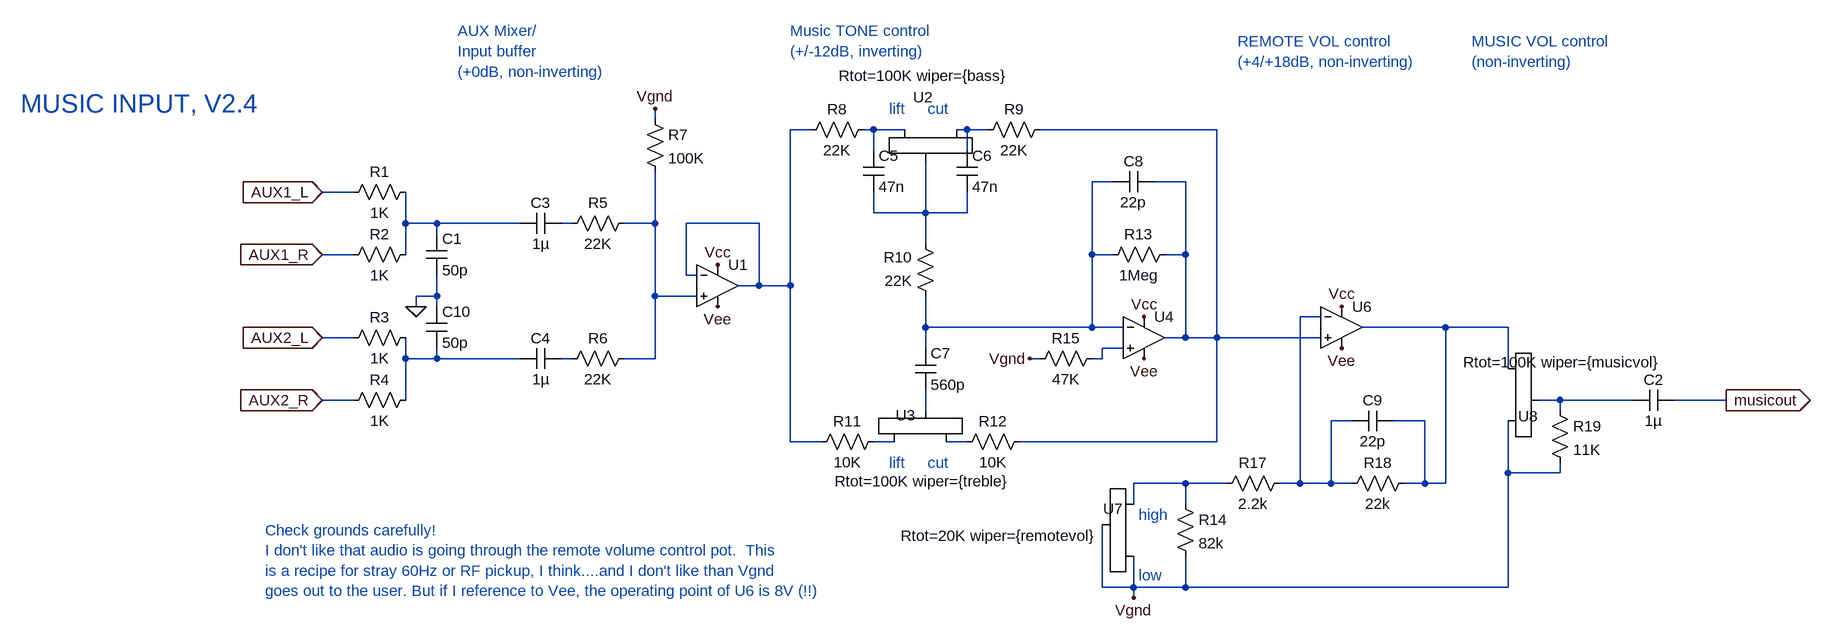
[diagram p0: schematic NewMusicInput_V2.4.asc]
NewMusicInput_V2.4.asc, the LTspice schematic file:
Version 4
SHEET 1 2328 872
WIRE 480 -32 480 -48
WIRE 720 -16 688 -16
WIRE 816 -16 800 -16
WIRE 864 -16 816 -16
WIRE 960 -16 944 -16
WIRE 992 -16 960 -16
WIRE 1344 -16 1072 -16
WIRE 816 16 816 -16
WIRE 960 16 960 -16
WIRE 1184 64 1152 64
WIRE 1296 64 1248 64
WIRE 16 80 -32 80
WIRE 816 112 816 80
WIRE 896 112 896 32
WIRE 896 112 816 112
WIRE 960 112 960 80
WIRE 960 112 896 112
WIRE 96 128 96 80
WIRE 144 128 96 128
WIRE 272 128 144 128
WIRE 352 128 336 128
WIRE 480 128 480 48
WIRE 480 128 432 128
WIRE 640 128 528 128
WIRE 144 144 144 128
WIRE 896 160 896 112
WIRE 16 176 -32 176
WIRE 96 176 96 128
WIRE 1152 176 1152 64
WIRE 1184 176 1152 176
WIRE 1296 176 1296 64
WIRE 1296 176 1264 176
WIRE 528 208 528 128
WIRE 544 208 528 208
WIRE 640 224 640 128
WIRE 640 224 608 224
WIRE 688 224 688 -16
WIRE 688 224 640 224
WIRE 144 240 144 208
WIRE 144 240 112 240
WIRE 480 240 480 128
WIRE 544 240 480 240
WIRE 112 256 112 240
WIRE 144 256 144 240
WIRE 1504 272 1472 272
WIRE 896 288 896 240
WIRE 1152 288 1152 176
WIRE 1152 288 896 288
WIRE 1200 288 1152 288
WIRE 1696 288 1568 288
WIRE 1792 288 1696 288
WIRE 16 304 -32 304
WIRE 1296 304 1296 176
WIRE 1296 304 1264 304
WIRE 1344 304 1344 -16
WIRE 1344 304 1296 304
WIRE 1504 304 1344 304
WIRE 896 320 896 288
WIRE 1200 320 1168 320
WIRE 96 336 96 304
WIRE 144 336 144 320
WIRE 144 336 96 336
WIRE 272 336 144 336
WIRE 352 336 336 336
WIRE 480 336 480 240
WIRE 480 336 432 336
WIRE 1072 336 1056 336
WIRE 1168 336 1168 320
WIRE 1168 336 1152 336
WIRE 1792 352 1792 288
WIRE 16 400 -32 400
WIRE 96 400 96 336
WIRE 1872 400 1840 400
WIRE 1984 400 1872 400
WIRE 2128 400 2048 400
WIRE 896 416 896 384
WIRE 1872 416 1872 400
WIRE 1552 432 1520 432
WIRE 1664 432 1616 432
WIRE 688 464 688 224
WIRE 736 464 688 464
WIRE 848 464 816 464
WIRE 960 464 928 464
WIRE 1344 464 1344 304
WIRE 1344 464 1040 464
WIRE 1792 512 1792 432
WIRE 1872 512 1872 496
WIRE 1872 512 1792 512
WIRE 1296 528 1216 528
WIRE 1360 528 1296 528
WIRE 1472 528 1472 272
WIRE 1472 528 1440 528
WIRE 1520 528 1520 432
WIRE 1520 528 1472 528
WIRE 1552 528 1520 528
WIRE 1664 528 1664 432
WIRE 1664 528 1632 528
WIRE 1696 528 1696 288
WIRE 1696 528 1664 528
WIRE 1216 560 1216 528
WIRE 1296 560 1296 528
WIRE 1168 688 1168 592
WIRE 1216 688 1216 640
WIRE 1216 688 1168 688
WIRE 1296 688 1296 640
WIRE 1296 688 1216 688
WIRE 1792 688 1792 512
WIRE 1792 688 1296 688
WIRE 1216 704 1216 688
FLAG 576 192 Vcc
FLAG 1232 272 Vcc
FLAG 576 256 Vee
FLAG 1232 336 Vee
FLAG 1536 256 Vcc
FLAG 1536 320 Vee
FLAG 2128 400 musicout
IOPIN 2128 400 Out
FLAG -32 80 AUX1_L
IOPIN -32 80 In
FLAG -32 176 AUX1_R
IOPIN -32 176 In
FLAG -32 304 AUX2_L
IOPIN -32 304 In
FLAG -32 400 AUX2_R
IOPIN -32 400 In
FLAG 480 -48 Vgnd
FLAG 1056 336 Vgnd
FLAG 112 256 0
FLAG 1216 704 Vgnd
SYMBOL res 112 64 R90
WINDOW 0 0 56 VBottom 2
WINDOW 3 32 56 VTop 2
SYMATTR InstName R1
SYMATTR Value 1K
SYMBOL res 112 160 R90
WINDOW 0 0 56 VBottom 2
WINDOW 3 32 56 VTop 2
SYMATTR InstName R2
SYMATTR Value 1K
SYMBOL res 112 288 R90
WINDOW 0 0 56 VBottom 2
WINDOW 3 32 56 VTop 2
SYMATTR InstName R3
SYMATTR Value 1K
SYMBOL res 112 384 R90
WINDOW 0 0 56 VBottom 2
WINDOW 3 32 56 VTop 2
SYMATTR InstName R4
SYMATTR Value 1K
SYMBOL cap 128 144 R0
SYMATTR InstName C1
SYMATTR Value 50p
SYMBOL cap 336 112 R90
WINDOW 0 0 32 VBottom 2
WINDOW 3 32 32 VTop 2
SYMATTR InstName C3
SYMATTR Value 1µ
SYMBOL cap 336 320 R90
WINDOW 0 0 32 VBottom 2
WINDOW 3 32 32 VTop 2
SYMATTR InstName C4
SYMATTR Value 1µ
SYMBOL res 448 112 R90
WINDOW 0 0 56 VBottom 2
WINDOW 3 32 56 VTop 2
SYMATTR InstName R5
SYMATTR Value 22K
SYMBOL res 448 320 R90
WINDOW 0 0 56 VBottom 2
WINDOW 3 32 56 VTop 2
SYMATTR InstName R6
SYMATTR Value 22K
SYMBOL res 464 -48 R0
SYMATTR InstName R7
SYMATTR Value 100K
SYMBOL potentiometer_standard 960 -32 R90
WINDOW 0 -34 52 VRight 2
WINDOW 3 -67 -63 VRight 2
WINDOW 39 -72 -23 Invisible 2
WINDOW 38 48 41 Invisible 2
SYMATTR InstName U2
SYMATTR Value Rtot=100K wiper={bass}
SYMBOL potentiometer_standard 832 480 R270
WINDOW 0 57 18 VRight 2
WINDOW 3 -45 -76 VRight 2
WINDOW 39 -72 -23 Invisible 2
WINDOW 38 48 41 Invisible 2
SYMATTR InstName U3
SYMATTR Value Rtot=100K wiper={treble}
SYMBOL res 816 -32 R90
WINDOW 0 0 56 VBottom 2
WINDOW 3 32 56 VTop 2
SYMATTR InstName R8
SYMATTR Value 22K
SYMBOL res 1088 -32 R90
WINDOW 0 0 56 VBottom 2
WINDOW 3 32 56 VTop 2
SYMATTR InstName R9
SYMATTR Value 22K
SYMBOL res 912 256 R180
WINDOW 0 36 76 Left 2
WINDOW 3 36 40 Left 2
SYMATTR InstName R10
SYMATTR Value 22K
SYMBOL res 720 480 R270
WINDOW 0 32 56 VTop 2
WINDOW 3 0 56 VBottom 2
SYMATTR InstName R11
SYMATTR Value 10K
SYMBOL res 944 480 R270
WINDOW 0 32 56 VTop 2
WINDOW 3 0 56 VBottom 2
SYMATTR InstName R12
SYMATTR Value 10K
SYMBOL res 1168 192 R270
WINDOW 0 32 56 VTop 2
WINDOW 3 0 56 VBottom 2
SYMATTR InstName R13
SYMATTR Value 1Meg
SYMBOL cap 800 16 R0
SYMATTR InstName C5
SYMATTR Value 47n
SYMBOL cap 944 16 R0
SYMATTR InstName C6
SYMATTR Value 47n
SYMBOL cap 880 320 R0
SYMATTR InstName C7
SYMATTR Value 560p
SYMBOL cap 1248 48 R90
WINDOW 0 0 32 VBottom 2
WINDOW 3 32 32 VTop 2
SYMATTR InstName C8
SYMATTR Value 22p
SYMBOL Opamps/UniversalOpAmp 576 224 R0
SYMATTR InstName U1
SYMATTR Value2 Avol=100K GBW=1Meg Vos=0
SYMBOL Opamps/UniversalOpAmp 1232 304 R0
SYMATTR InstName U4
SYMATTR Value2 Avol=100K GBW=1Meg Vos=0
SYMBOL cap 128 256 R0
SYMATTR InstName C10
SYMATTR Value 50p
SYMBOL Opamps/UniversalOpAmp 1536 288 R0
SYMATTR InstName U6
SYMATTR Value2 Avol=100K GBW=1Meg Vos=0
SYMBOL res 1280 544 R0
SYMATTR InstName R14
SYMATTR Value 82k
SYMBOL res 1456 512 R90
WINDOW 0 0 56 VBottom 2
WINDOW 3 32 56 VTop 2
SYMATTR InstName R17
SYMATTR Value 2.2k
SYMBOL res 1648 512 R90
WINDOW 0 0 56 VBottom 2
WINDOW 3 32 56 VTop 2
SYMATTR InstName R18
SYMATTR Value 22k
SYMBOL cap 1616 416 R90
WINDOW 0 0 32 VBottom 2
WINDOW 3 32 32 VTop 2
SYMATTR InstName C9
SYMATTR Value 22p
SYMBOL potentiometer_standard 1232 656 R180
WINDOW 0 32 89 Left 2
WINDOW 3 71 47 Left 2
WINDOW 39 48 112 Invisible 2
WINDOW 38 48 41 Invisible 2
SYMATTR InstName U7
SYMATTR Value Rtot=20K wiper={remotevol}
SYMBOL potentiometer_standard 1776 336 R0
WINDOW 0 32 89 Left 2
WINDOW 3 -53 6 Left 2
WINDOW 39 48 112 Invisible 2
WINDOW 38 48 41 Invisible 2
SYMATTR InstName U8
SYMATTR Value Rtot=100K wiper={musicvol}
SYMBOL res 1856 400 R0
SYMATTR InstName R19
SYMATTR Value 11K
SYMBOL cap 2048 384 R90
WINDOW 0 0 32 VBottom 2
WINDOW 3 32 32 VTop 2
SYMATTR InstName C2
SYMATTR Value 1µ
SYMBOL res 1168 320 R90
WINDOW 0 0 56 VBottom 2
WINDOW 3 32 56 VTop 2
SYMATTR InstName R15
SYMATTR Value 47K
TEXT 840 -48 Left 2 ;lift     cut
TEXT 840 496 Left 2 ;lift     cut
TEXT 688 -168 Left 2 ;Music TONE control\n(+/-12dB, inverting)
TEXT 176 -168 Left 2 ;AUX Mixer/\nInput buffer\n(+0dB, non-inverting)
TEXT 1376 -152 Left 2 ;REMOTE VOL control\n(+4/+18dB, non-inverting)
TEXT -120 600 Left 2 ;Check grounds carefully!\nI don't like that audio is going through the remote volume control pot.  This \nis a recipe for stray 60Hz or RF pickup, I think....and I don't like than Vgnd\ngoes out to the user. But if I reference to Vee, the operating point of U6 is 8V (!!)
TEXT 1736 -152 Left 2 ;MUSIC VOL control\n(non-inverting)
TEXT 1224 576 Left 2 ;high\n \n\nlow
TEXT -496 -56 Left 4 ;MUSIC INPUT, V2.4

The netlist it stands for:
* NewMusicInput_V2.4.asc
R1 N007 AUX1_L 1K
R2 N007 AUX1_R 1K
R3 N013 AUX2_L 1K
R4 N013 AUX2_R 1K
C1 N007 0 50p
C3 N008 N007 1µ
C4 N014 N013 1µ
R5 N009 N008 22K
R6 N009 N014 22K
R7 Vgnd N009 100K
XU2 N003 N002 N006 Rtot=100K wiper={bass}
XU3 N017 N018 N016 Rtot=100K wiper={treble}
R8 N002 N001 22K
R9 N004 N003 22K
R10 N005 N006 22K
R11 N001 N017 10K
R12 N018 N004 10K
R13 N005 N004 1Meg
C5 N002 N006 47n
C6 N003 N006 47n
C7 N005 N016 560p
C8 N004 N005 22p
XU1 N009 N001 Vcc Vee N001 level1 Avol=100K GBW=1Meg Vos=0 En=0 Enk=0 In=0 Ink=0 Rin=500Meg  ; pins In+ In- V+ V- OUT
XU4 N012 N005 Vcc Vee N004 level1 Avol=100K GBW=1Meg Vos=0 En=0 Enk=0 In=0 Ink=0 Rin=500Meg  ; pins In+ In- V+ V- OUT
C10 0 N013 50p
XU6 N004 N010 Vcc Vee N011 level1 Avol=100K GBW=1Meg Vos=0 En=0 Enk=0 In=0 Ink=0 Rin=500Meg  ; pins In+ In- V+ V- OUT
R14 N019 Vgnd 82k
R17 N010 N019 2.2k
R18 N011 N010 22k
C9 N011 N010 22p
XU7 Vgnd N019 Vgnd Rtot=20K wiper={remotevol}
XU8 N011 Vgnd N015 Rtot=100K wiper={musicvol}
R19 N015 Vgnd 11K
C2 musicout N015 1µ
R15 N012 Vgnd 47K
* lift     cut
* lift     cut
* Music TONE control
* (+/-12dB, inverting)
* AUX Mixer/
* Input buffer
* (+0dB, non-inverting)
* REMOTE VOL control
* (+4/+18dB, non-inverting)
* Check grounds carefully!
* I don't like that audio is going through the remote volume control pot.  This
* is a recipe for stray 60Hz or RF pickup, I think....and I don't like than Vgnd
* goes out to the user. But if I reference to Vee, the operating point of U6 is 8V (!!)
* MUSIC VOL control
* (non-inverting)
* high
* low
* MUSIC INPUT, V2.4
.lib UniversalOpAmp1.lib
.backanno
.end